# Altium schematic sheet Power.SchDoc: Power
size A4; Date: 15.03.2026; Author: Vamsi Krishna Sesham; DrawnBy: Vamsi Krishna Sesham; Engineer: Vamsi Krishna Sesham; Revision: C; SheetNumber: 4; SheetTotal: 6
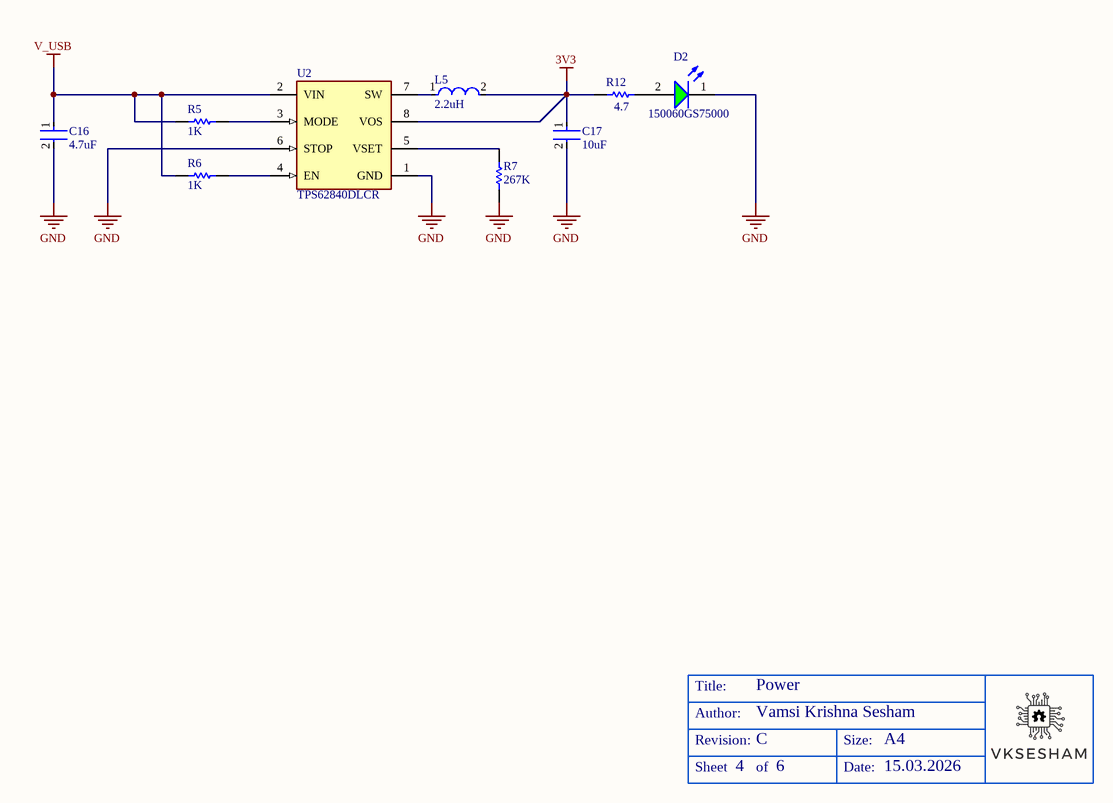
[diagram p0: Power.SchDoc]

## Parts
*  TitleBlock  (value not drawn)  (graphical)
C16  4.7uF  [FP-CC0402-MFG]
C17  10uF  [FP-CL07-IPC_C]
D2  150060GS75000  [WL-SMCW_0603_150060xx75000]
L5  2.2uH  [FP-DFE201612C-MFG]
R5  1K  [RESC0603X28X15ML05T05]
R6  1K  [RESC0603X28X15ML05T05]
R7  267K  [RESC1005X40X25ML05T05]
R12  4.7  [RESC0402(1005)_M]
U2  TPS62840DLCR  [FP-DLC0008B-MFG]

## Nets
3V3: C17.1 L5.2 R12.1 U2.8(VOS)
GND: C16.2 C17.2 D2.1(K) R7.1 U2.1(GND) U2.6(STOP)
V_USB: C16.1 R5.1 R6.1 U2.2(VIN)
NetD2_2: D2.2(A) R12.2
NetL5_1: L5.1 U2.7(SW)
NetR5_2: R5.2 U2.3(MODE)
NetR6_2: R6.2 U2.4(EN)
NetR7_2: R7.2 U2.5(VSET)

## Notes on the sheet
- (in symbol TitleBlock) Title:; Author:; Revision:; Size:; A4; Sheet; of; Date:

## Library data of the parts
C16 = CMP-03422-000819-1: CAP CER 4.7UF 16V X5R 0402; Manufacturer Part Number: CC0402MRX5R7BB475; Manufacturer: YAGEO; Tolerance: 0.2; Automotive Grade: NA; Material: Ceramic; Temperature Coefficient: 30ppm/°C; Digikey Description: CAP CER 4.7UF 16V X5R 0402; Capacitance: 4.7 uF; Lead Free: Yes; Octopart: https://octopart.com/cc0402mrx5r7bb475-yageo-81932628; Device Class L3: Ceramic Capacitors; Ipc Land Pattern Name: CAPC10050X50; Package: CC0402; Temperature: -55°C to +125°C; Device Class L2: Capacitors; Value: 4.7 uF; Temperature Characteristic: X5R; ComponentLink2URL: http://www.yageo.com/documents/recent/UPY-GP_NP0_16V-to-50V_16.pdf; Temperature Range Low: -55°C; Automotive: No; ComponentLink2Description: Datasheet; Category: Cap; Mouser Description: Multilayer Ceramic Capacitors MLCC - SMD/SMT 4.7uF 16V 20% Ceramic Capacitor; Temperature Range High: +125°C; Voltage Rating: 16 V; Footprint Url: http://www.yageo.com/exep/pages/download/literatures/UPY-C_GEN_24.pdf; Height: 0.55mm; RoHS: TRUE; Device Class L1: Passive Components
C17 = CMP-13271-002778-1: Cap Ceramic 10uF 10V X5R ±20% SMD 0402 +85°C Paper T/R; Length: 0.039inch; Mount: Surface Mount; Case Code (Imperial): 0402; Capacitance: 10uF; Max Operating Temperature: 85°C; Voltage Rating: 10V; Min Operating Temperature: -55°C; Case/Package: 0402; Thickness: 0.035inch; Width: 0.02inch; Case Code (Metric): 1005; Packaging: Tape and Reel; Tolerance: 20%
D2 = CMP-1426-00002-4: 430mcd Colorless transparence 520nm Emerald 140° LED0603 Light Emitting Diodes (LED) ROHS; Peak Wavelength: 515nm; Forward Current: 100mA; Reverse Voltage: 5V; Output Current: 10µA; Power Dissipation: 105mW; Lens Style: Clear, Rectangular; Dominant Wavelength: 525nm; Color: Green; Test Current: 20mA; Max Junction Temperature (Tj): 95°C; Forward Voltage: 3.2V; Width: 800µm; Max Operating Temperature: 85°C; Case Code (Metric): 1608; Luminous Intensity: 430mcd; Lead Free: Lead Free; Case/Package: 0603; Case Code (Imperial): 0603; Mount: Surface Mount; Max Reverse Voltage (DC): 5V; Packaging: Tape and Reel; RoHS: Compliant; Viewing Angle: 140°; REACH SVHC: Unknown; Min Operating Temperature: -40°C; Height: 700µm; Wavelength: 525nm; Length: 1.6mm
L5 = CMP-06042-009962-1: Shielded Wirewound Inductor 2.2uH 20% 1800mA 0.116Ω 0806 (2016)
R5 R6 = CMP-2004-00209-1: Manufacturer: Vishay Dale; Part Number: CRCW02011K00FNED
R7 = CMP-2002-00823-1: Part Number: ERJ-2RKF2673X; Manufacturer: Panasonic
R12 = CMP-1011-00018-1: 4R7 0.063W 5% 0402 (1005 Metric)  SMD; Value: 4.70 Ohm; Case-EIA: 0402; Case-Metric: 1005; Power: 0.063 W; Technology: SMT; Tolerance: 5 %
U2 = CMP-04918-000086-1: ULTRA LOW IQ BUCK CONVERTER; Manufacturer: Texas Instruments; Standoff Height: 0mm; Nominal Supply Current: 0.005-3000uA; Switching Frequency: 1.8MHz; Max Duty Cycle: 100%; Min Supply Voltage: 1.8V; Output Current: 750mA; Max Supply Voltage: 6.5V; Max Junction Temp: +125°C; Output Type: AdjustableProgrammable; Output Voltage: 1.8-3.3V; Number Of Outputs: 1; Device Class L1: Integrated Circuits (ICs); Device Class L3: Voltage Regulators - Switching; RoHS: TRUE; Automotive: No; Package: DLC0008B; ComponentLink2URL: http://www.ti.com/lit/ds/symlink/tps62840.pdf; Height: 1mm; Lead Free: Yes; Octopart: https://octopart.com/tps62840dlcr-texas+instruments-103121111; Mouser Description: 60-nA IQ, 1.8-V to 6.5-VIN, high-efficiency 750-mA step-down converter 8-VSON-HR -40 to 125; Manufacturer Part Number: TPS62840DLCR; Ipc Land Pattern Name: DFN200X150X100-8; Temperature: -40°C to +125°C; ComponentLink2Description: Datasheet; Switching Topology: Buck; Temperature Range Low: -40°C; Device Class L2: Power Management ICs; Temperature Range High: +125°C; Digikey Description: ULTRA LOW IQ BUCK CONVERTER; Category: IC